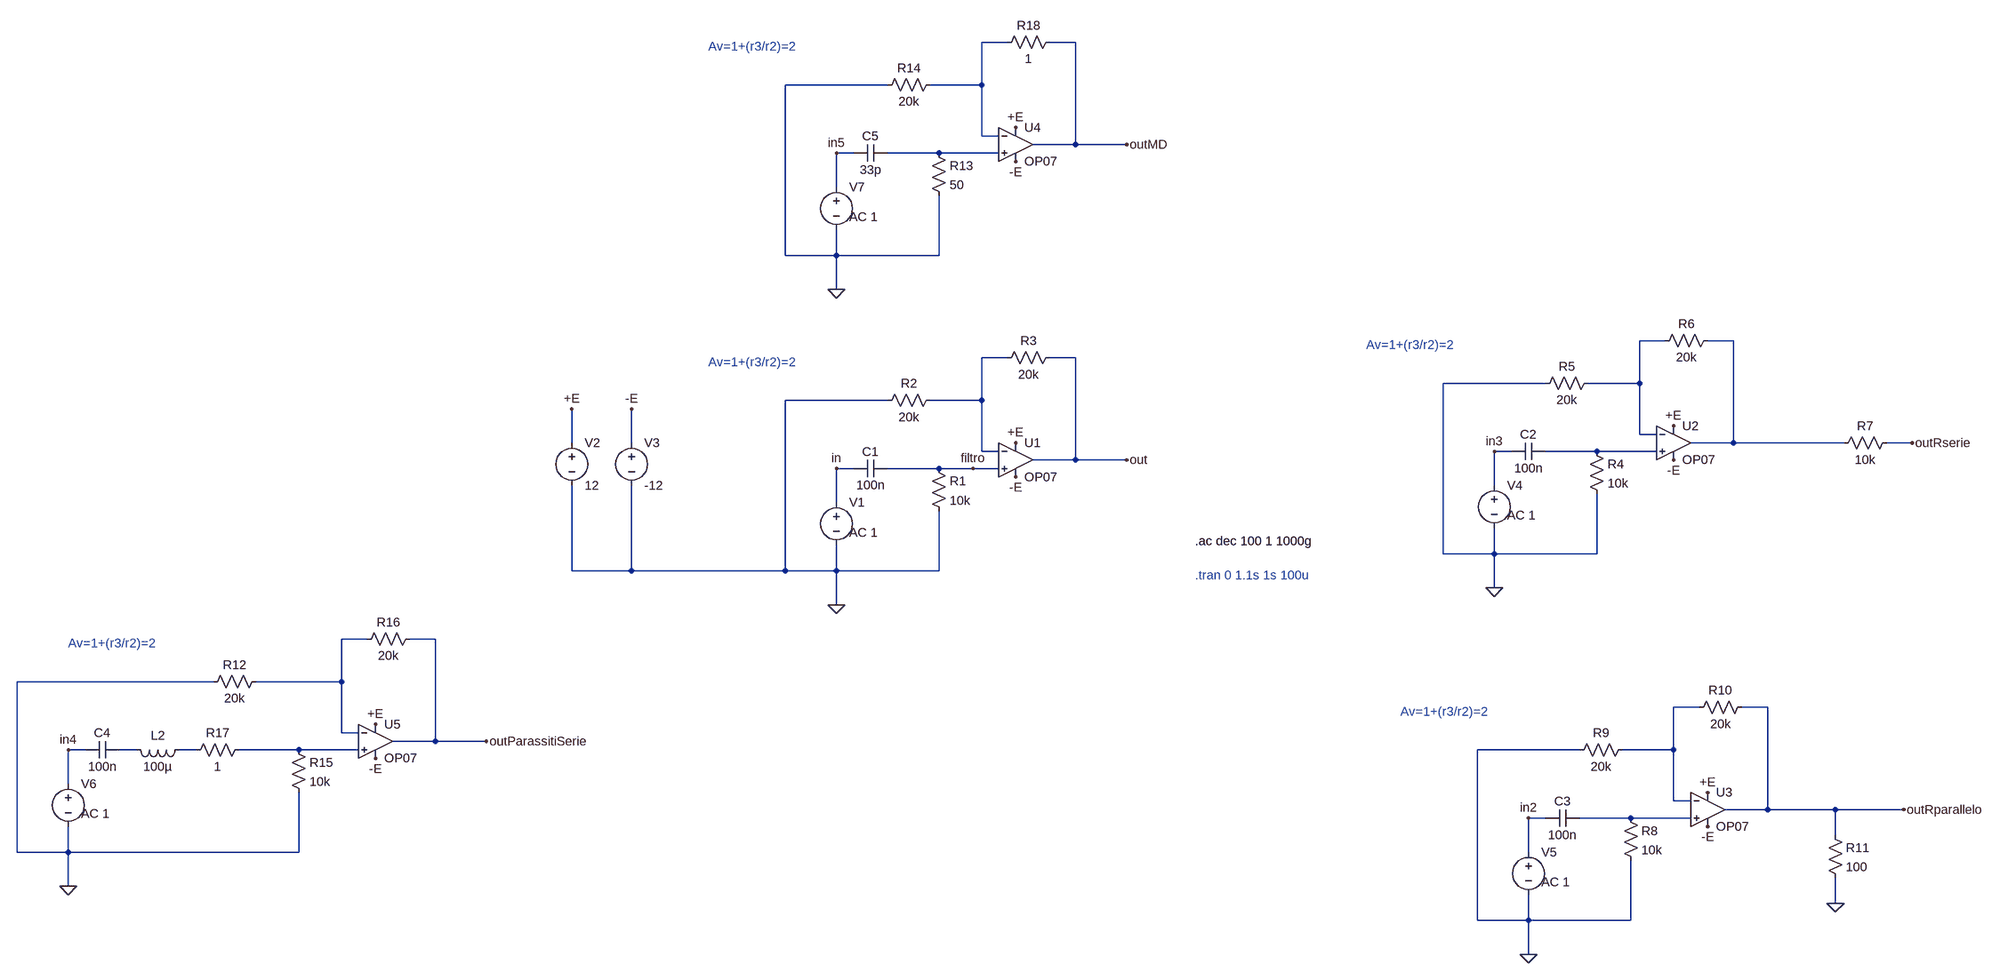
[diagram p0: schematic filto-passa-alto-rc-attivo-reale.asc]
filto-passa-alto-rc-attivo-reale.asc, the LTspice schematic file:
Version 4.1
SHEET 1 2572 1156
WIRE 336 -576 288 -576
WIRE 464 -576 416 -576
WIRE 112 -496 -80 -496
WIRE 288 -496 288 -576
WIRE 288 -496 192 -496
WIRE 288 -400 288 -496
WIRE 320 -400 288 -400
WIRE 464 -384 464 -576
WIRE 464 -384 384 -384
WIRE 560 -384 464 -384
WIRE 48 -368 16 -368
WIRE 208 -368 112 -368
WIRE 320 -368 208 -368
WIRE 16 -304 16 -368
WIRE -80 -176 -80 -496
WIRE 16 -176 16 -224
WIRE 16 -176 -80 -176
WIRE 208 -176 208 -288
WIRE 208 -176 16 -176
WIRE 16 -112 16 -176
WIRE 1936 -16 1888 -16
WIRE 2064 -16 2016 -16
WIRE 336 16 288 16
WIRE 464 16 416 16
WIRE 1712 64 1520 64
WIRE 1888 64 1888 -16
WIRE 1888 64 1792 64
WIRE 112 96 -80 96
WIRE 288 96 288 16
WIRE 288 96 192 96
WIRE 1888 160 1888 64
WIRE 1920 160 1888 160
WIRE -480 176 -480 112
WIRE -368 176 -368 112
WIRE 2064 176 2064 -16
WIRE 2064 176 1984 176
WIRE 2288 176 2064 176
WIRE 2416 176 2368 176
WIRE 288 192 288 96
WIRE 320 192 288 192
WIRE 1648 192 1616 192
WIRE 1808 192 1712 192
WIRE 1920 192 1808 192
WIRE 464 208 464 16
WIRE 464 208 384 208
WIRE 560 208 464 208
WIRE 48 224 16 224
WIRE 208 224 112 224
WIRE 272 224 208 224
WIRE 320 224 272 224
WIRE 1616 256 1616 192
WIRE 16 288 16 224
WIRE 1520 384 1520 64
WIRE 1616 384 1616 336
WIRE 1616 384 1520 384
WIRE 1808 384 1808 272
WIRE 1808 384 1616 384
WIRE -480 416 -480 256
WIRE -368 416 -368 256
WIRE -368 416 -480 416
WIRE -80 416 -80 96
WIRE -80 416 -368 416
WIRE 16 416 16 368
WIRE 16 416 -80 416
WIRE 208 416 208 304
WIRE 208 416 16 416
WIRE 1616 448 1616 384
WIRE 16 480 16 416
WIRE -864 544 -912 544
WIRE -736 544 -784 544
WIRE -1152 624 -1520 624
WIRE -912 624 -912 544
WIRE -912 624 -1072 624
WIRE 2000 672 1952 672
WIRE 2128 672 2080 672
WIRE -912 720 -912 624
WIRE -880 720 -912 720
WIRE -736 736 -736 544
WIRE -736 736 -816 736
WIRE -640 736 -736 736
WIRE -1392 752 -1424 752
WIRE -1296 752 -1328 752
WIRE -1184 752 -1216 752
WIRE -992 752 -1104 752
WIRE -880 752 -992 752
WIRE 1776 752 1584 752
WIRE 1952 752 1952 672
WIRE 1952 752 1856 752
WIRE -1424 816 -1424 752
WIRE 1952 848 1952 752
WIRE 1984 848 1952 848
WIRE 2128 864 2128 672
WIRE 2128 864 2048 864
WIRE 2272 864 2128 864
WIRE 2400 864 2272 864
WIRE 1712 880 1680 880
WIRE 1872 880 1776 880
WIRE 1984 880 1872 880
WIRE 2272 912 2272 864
WIRE -1520 944 -1520 624
WIRE -1424 944 -1424 896
WIRE -1424 944 -1520 944
WIRE -992 944 -992 832
WIRE -992 944 -1424 944
WIRE 1680 944 1680 880
WIRE -1424 1008 -1424 944
WIRE 2272 1040 2272 992
WIRE 1584 1072 1584 752
WIRE 1680 1072 1680 1024
WIRE 1680 1072 1584 1072
WIRE 1872 1072 1872 960
WIRE 1872 1072 1680 1072
WIRE 1680 1136 1680 1072
FLAG 16 480 0
FLAG 560 208 out
FLAG 16 224 in
FLAG -480 112 +E
FLAG -368 112 -E
FLAG 272 224 filtro
FLAG 352 176 +E
FLAG 352 240 -E
FLAG 2272 1040 0
FLAG 2416 176 outRserie
FLAG 2400 864 outRparallelo
FLAG 1616 448 0
FLAG 1616 192 in3
FLAG 1952 144 +E
FLAG 1952 208 -E
FLAG 1680 1136 0
FLAG 1680 880 in2
FLAG 2016 832 +E
FLAG 2016 896 -E
FLAG -640 736 outParassitiSerie
FLAG -848 704 +E
FLAG -848 768 -E
FLAG -1424 1008 0
FLAG -1424 752 in4
FLAG 16 -112 0
FLAG 560 -384 outMD
FLAG 16 -368 in5
FLAG 352 -416 +E
FLAG 352 -352 -E
SYMBOL cap 112 208 R90
WINDOW 0 0 32 VBottom 2
WINDOW 3 32 32 VTop 2
SYMATTR InstName C1
SYMATTR Value 100n
SYMBOL res 192 208 R0
SYMATTR InstName R1
SYMATTR Value 10k
SYMBOL res 208 80 R90
WINDOW 0 0 56 VBottom 2
WINDOW 3 32 56 VTop 2
SYMATTR InstName R2
SYMATTR Value 20k
SYMBOL res 432 0 R90
WINDOW 0 0 56 VBottom 2
WINDOW 3 32 56 VTop 2
SYMATTR InstName R3
SYMATTR Value 20k
SYMBOL voltage 16 272 R0
WINDOW 3 24 44 Left 2
WINDOW 123 24 72 Left 2
WINDOW 39 0 0 Left 0
SYMATTR Value ""
SYMATTR Value2 AC 1
SYMATTR InstName V1
SYMBOL voltage -480 160 R0
WINDOW 123 0 0 Left 0
WINDOW 39 0 0 Left 0
SYMATTR InstName V2
SYMATTR Value 12
SYMBOL voltage -368 160 R0
WINDOW 123 0 0 Left 0
WINDOW 39 0 0 Left 0
SYMATTR InstName V3
SYMATTR Value -12
SYMBOL res 2384 160 R90
WINDOW 0 0 56 VBottom 2
WINDOW 3 32 56 VTop 2
SYMATTR InstName R7
SYMATTR Value 10k
SYMBOL res 2256 896 R0
SYMATTR InstName R11
SYMATTR Value 100
SYMBOL OpAmps\\OP07 352 144 R0
SYMATTR InstName U1
SYMBOL cap 1712 176 R90
WINDOW 0 0 32 VBottom 2
WINDOW 3 32 32 VTop 2
SYMATTR InstName C2
SYMATTR Value 100n
SYMBOL res 1792 176 R0
SYMATTR InstName R4
SYMATTR Value 10k
SYMBOL res 1808 48 R90
WINDOW 0 0 56 VBottom 2
WINDOW 3 32 56 VTop 2
SYMATTR InstName R5
SYMATTR Value 20k
SYMBOL res 2032 -32 R90
WINDOW 0 0 56 VBottom 2
WINDOW 3 32 56 VTop 2
SYMATTR InstName R6
SYMATTR Value 20k
SYMBOL voltage 1616 240 R0
WINDOW 3 24 44 Left 2
WINDOW 123 24 72 Left 2
WINDOW 39 0 0 Left 0
SYMATTR Value ""
SYMATTR Value2 AC 1
SYMATTR InstName V4
SYMBOL OpAmps\\OP07 1952 112 R0
SYMATTR InstName U2
SYMBOL cap 1776 864 R90
WINDOW 0 0 32 VBottom 2
WINDOW 3 32 32 VTop 2
SYMATTR InstName C3
SYMATTR Value 100n
SYMBOL res 1856 864 R0
SYMATTR InstName R8
SYMATTR Value 10k
SYMBOL res 1872 736 R90
WINDOW 0 0 56 VBottom 2
WINDOW 3 32 56 VTop 2
SYMATTR InstName R9
SYMATTR Value 20k
SYMBOL res 2096 656 R90
WINDOW 0 0 56 VBottom 2
WINDOW 3 32 56 VTop 2
SYMATTR InstName R10
SYMATTR Value 20k
SYMBOL voltage 1680 928 R0
WINDOW 3 24 44 Left 2
WINDOW 123 24 72 Left 2
WINDOW 39 0 0 Left 0
SYMATTR Value ""
SYMATTR Value2 AC 1
SYMATTR InstName V5
SYMBOL OpAmps\\OP07 2016 800 R0
SYMATTR InstName U3
SYMBOL res -1008 736 R0
SYMATTR InstName R15
SYMATTR Value 10k
SYMBOL res -768 528 R90
WINDOW 0 0 56 VBottom 2
WINDOW 3 32 56 VTop 2
SYMATTR InstName R16
SYMATTR Value 20k
SYMBOL OpAmps\\OP07 -848 672 R0
SYMATTR InstName U5
SYMBOL cap -1328 736 R90
WINDOW 0 0 32 VBottom 2
WINDOW 3 32 32 VTop 2
SYMATTR InstName C4
SYMATTR Value 100n
SYMBOL voltage -1424 800 R0
WINDOW 3 24 44 Left 2
WINDOW 123 24 72 Left 2
WINDOW 39 0 0 Left 0
SYMATTR Value ""
SYMATTR Value2 AC 1
SYMATTR InstName V6
SYMBOL ind -1200 736 R90
WINDOW 0 5 56 VBottom 2
WINDOW 3 32 56 VTop 2
SYMATTR InstName L2
SYMATTR Value 100µ
SYMATTR SpiceLine Rser=1m
SYMBOL res -1088 736 R90
WINDOW 0 0 56 VBottom 2
WINDOW 3 32 56 VTop 2
SYMATTR InstName R17
SYMATTR Value 1
SYMBOL res -1056 608 R90
WINDOW 0 0 56 VBottom 2
WINDOW 3 32 56 VTop 2
SYMATTR InstName R12
SYMATTR Value 20k
SYMBOL cap 112 -384 R90
WINDOW 0 0 32 VBottom 2
WINDOW 3 32 32 VTop 2
SYMATTR InstName C5
SYMATTR Value 33p
SYMBOL res 192 -384 R0
SYMATTR InstName R13
SYMATTR Value 50
SYMBOL res 208 -512 R90
WINDOW 0 0 56 VBottom 2
WINDOW 3 32 56 VTop 2
SYMATTR InstName R14
SYMATTR Value 20k
SYMBOL res 432 -592 R90
WINDOW 0 0 56 VBottom 2
WINDOW 3 32 56 VTop 2
SYMATTR InstName R18
SYMATTR Value 1
SYMBOL voltage 16 -320 R0
WINDOW 3 24 44 Left 2
WINDOW 123 24 72 Left 2
WINDOW 39 0 0 Left 0
SYMATTR Value ""
SYMATTR Value2 AC 1
SYMATTR InstName V7
SYMBOL OpAmps\\OP07 352 -448 R0
SYMATTR InstName U4
TEXT -224 24 Left 2 ;Av=1+(r3/r2)=2
TEXT 688 360 Left 2 !.ac dec 100 1 1000g
TEXT 688 424 Left 2 ;.tran 0 1.1s 1s 100u
TEXT 1376 -8 Left 2 ;Av=1+(r3/r2)=2
TEXT 1440 680 Left 2 ;Av=1+(r3/r2)=2
TEXT -1424 552 Left 2 ;Av=1+(r3/r2)=2
TEXT -224 -568 Left 2 ;Av=1+(r3/r2)=2

The netlist it stands for:
* filto-passa-alto-rc-attivo-reale.asc
C1 filtro in 100n
R1 filtro 0 10k
R2 N005 0 20k
R3 out N005 20k
V1 in 0 AC 1
V2 +E 0 12
V3 -E 0 -12
R7 outRserie N004 10k
R11 outRparallelo 0 100
X§U1 filtro N005 +E -E out LT1001  ; OP07, pins In+ In- V+ V- OUT
C2 N006 in3 100n
R4 N006 0 10k
R5 N003 0 20k
R6 N004 N003 20k
V4 in3 0 AC 1
X§U2 N006 N003 +E -E N004 LT1001  ; OP07, pins In+ In- V+ V- OUT
C3 N012 in2 100n
R8 N012 0 10k
R9 N008 0 20k
R10 outRparallelo N008 20k
V5 in2 0 AC 1
X§U3 N012 N008 +E -E outRparallelo LT1001  ; OP07, pins In+ In- V+ V- OUT
R15 N011 0 10k
R16 outParassitiSerie N007 20k
X§U5 N011 N007 +E -E outParassitiSerie LT1001  ; OP07, pins In+ In- V+ V- OUT
C4 N009 in4 100n
V6 in4 0 AC 1
L2 N010 N009 100µ Rser=1m
R17 N011 N010 1
R12 N007 0 20k
C5 N002 in5 33p
R13 N002 0 50
R14 N001 0 20k
R18 outMD N001 1
V7 in5 0 AC 1
X§U4 N002 N001 +E -E outMD LT1001  ; OP07, pins In+ In- V+ V- OUT
* Av=1+(r3/r2)=2
.ac dec 100 1 1000g
* .tran 0 1.1s 1s 100u
* Av=1+(r3/r2)=2
* Av=1+(r3/r2)=2
* Av=1+(r3/r2)=2
* Av=1+(r3/r2)=2
.lib LTC.lib
.backanno
.end